# EAGLE design arduino nano pcb (EAGLE 9.6.2)
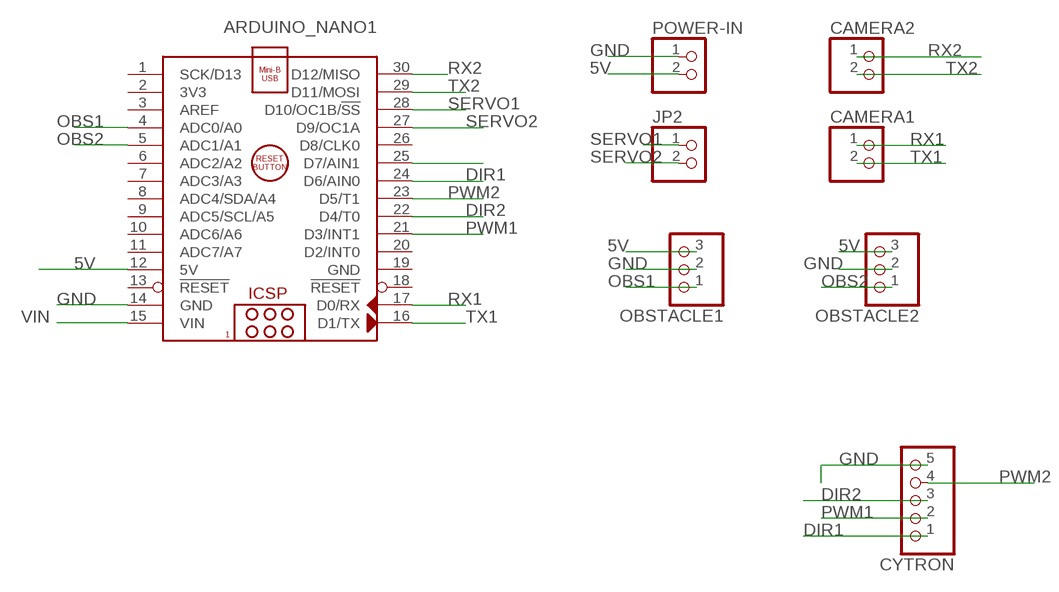
[diagram p0: schematic, sheet 1]

## Parts
ARDUINO_NANO1  ARDUINO_NANO  [ARDUINO_NANO]
CAMERA1  PINHD-1X2  [1X02]
CAMERA2  PINHD-1X2  [1X02]
CYTRON  PINHD-1X5  [1X05]
JP2  PINHD-1X2  [1X02]
OBSTACLE1  PINHD-1X3  [1X03]
OBSTACLE2  PINHD-1X3  [1X03]
POWER-IN  PINHD-1X2  [1X02]

## Nets
5V: ARDUINO_NANO1.12(5V) OBSTACLE1.3 OBSTACLE2.3 POWER-IN.2
DIR1: ARDUINO_NANO1.24(D6/AIN0) CYTRON.1
DIR2: ARDUINO_NANO1.22(D4/T0) CYTRON.3
GND: ARDUINO_NANO1.14(GND) CYTRON.5 OBSTACLE1.2 OBSTACLE2.2 POWER-IN.1
N$6: ARDUINO_NANO1.25(D7/AIN1)
OBS1: ARDUINO_NANO1.4(ADC0/A0) OBSTACLE1.1
OBS2: ARDUINO_NANO1.5(ADC1/A1) OBSTACLE2.1
PWM1: ARDUINO_NANO1.21(D3/INT1) CYTRON.2
PWM2: ARDUINO_NANO1.23(D5/T1) CYTRON.4
RX1: ARDUINO_NANO1.17(D0/RX) CAMERA1.1
RX2: ARDUINO_NANO1.30(D12/MISO) CAMERA2.1
SERVO1: ARDUINO_NANO1.28(D10/OC1B/!SS) JP2.1
SERVO2: ARDUINO_NANO1.27(D9/OC1A) JP2.2
TX1: ARDUINO_NANO1.16(D1/TX) CAMERA1.2
TX2: ARDUINO_NANO1.29(D11/MOSI) CAMERA2.2
VIN: ARDUINO_NANO1.15(VIN)
Unconnected: ARDUINO_NANO1.1(SCK/D13) ARDUINO_NANO1.2(3V3) ARDUINO_NANO1.3(AREF) ARDUINO_NANO1.6(ADC2/A2) ARDUINO_NANO1.7(ADC3/A3) ARDUINO_NANO1.8(ADC4/SDA/A4) ARDUINO_NANO1.9(ADC5/SCL/A5) ARDUINO_NANO1.10(ADC6/A6) ARDUINO_NANO1.11(ADC7/A7) ARDUINO_NANO1.13(!RESET) ARDUINO_NANO1.18(!RESET) ARDUINO_NANO1.20(D2/INT0) ARDUINO_NANO1.26(D8/CLK0)

## Power pins joined to a net without a drawn wire
GND: ARDUINO_NANO1.19(GND)

## Library data of the parts
ARDUINO_NANO1 = ArduinoNanoV30:ARDUINO_NANO: Arduino Nano V3.0 Module Overview: The Arduino Nano is a small, complete, and breadboard-friendly board based on the ATmega328 (Arduino Nano 3.x) or ATmega168 (Arduino Nano 2.x). It has more or less the same functionality of the Arduino Duemilanove, but in a different package. It lacks only a DC power jack, and works with a Mini-B USB cable instead of a standard one. The Nano was designed and is being produced by Gravitech <http://www.gravitech.us/arna30wiatp.html>. General specifications: Item Value Microcontroller Atmel ATmega168 or ATmega328 Operating Voltage (logic level) 5 V Input Voltage (recommended) 7-12 V Input Voltage (limits) 6-20 V Digital I/O Pins 14 (of which 6 provide PWM output) Analog Input Pins 8 DC Current per I/O Pin 40 mA Flash Memory 16 KB (ATmega168) or 32 KB (ATmega328) of which 2 KB used by bootloader SRAM 1 KB (ATmega168) or 2 KB (ATmega328) EEPROM 512 bytes (ATmega168) or 1 KB (ATmega328) Clock Speed 16 MHz Dimensions (Inches) 0.73" x 1.70" Dimensions (mm) 18mm x 45mm Overall height About 9 mm (not including pins) Weigth 5 g Power: The Arduino Nano can be powered via the Mini-B USB connection, 6-20V unregulated external power supply (pin 30), or 5V regulated external power supply (pin 27). The power source is automatically selected to the highest voltage source. Memory: The ATmega168 has 16 KB of flash memory for storing code (of which 2 KB is used for the bootloader); the ATmega328 has 32 KB, (also with 2 KB used for the bootloader). The ATmega168 has 1 KB of SRAM and 512 bytes of EEPROM (which can be read and written with the EEPROM library); the ATmega328 has 2 KB of SRAM and 1 KB of EEPROM. Input and Output: Each of the 14 digital pins on the Nano can be used as an input or output, using pinMode(), digitalWrite(), and digitalRead() functions. They operate at 5 volts. Each pin can provide or receive a maximum of 40 mA and has an internal pull-up resistor (disconnected by default) of 20-50 kOhms. In addition, some pins have specialized functions. Visit Arduino - ArduinoBoardNano <https://www.arduino.cc/en/Main/ArduinoBoardNano>
CAMERA1 CAMERA2 JP2 POWER-IN = pinhead:PINHD-1X2: PIN HEADER
CYTRON = pinhead:PINHD-1X5: PIN HEADER
OBSTACLE1 OBSTACLE2 = pinhead:PINHD-1X3: PIN HEADER

## Board
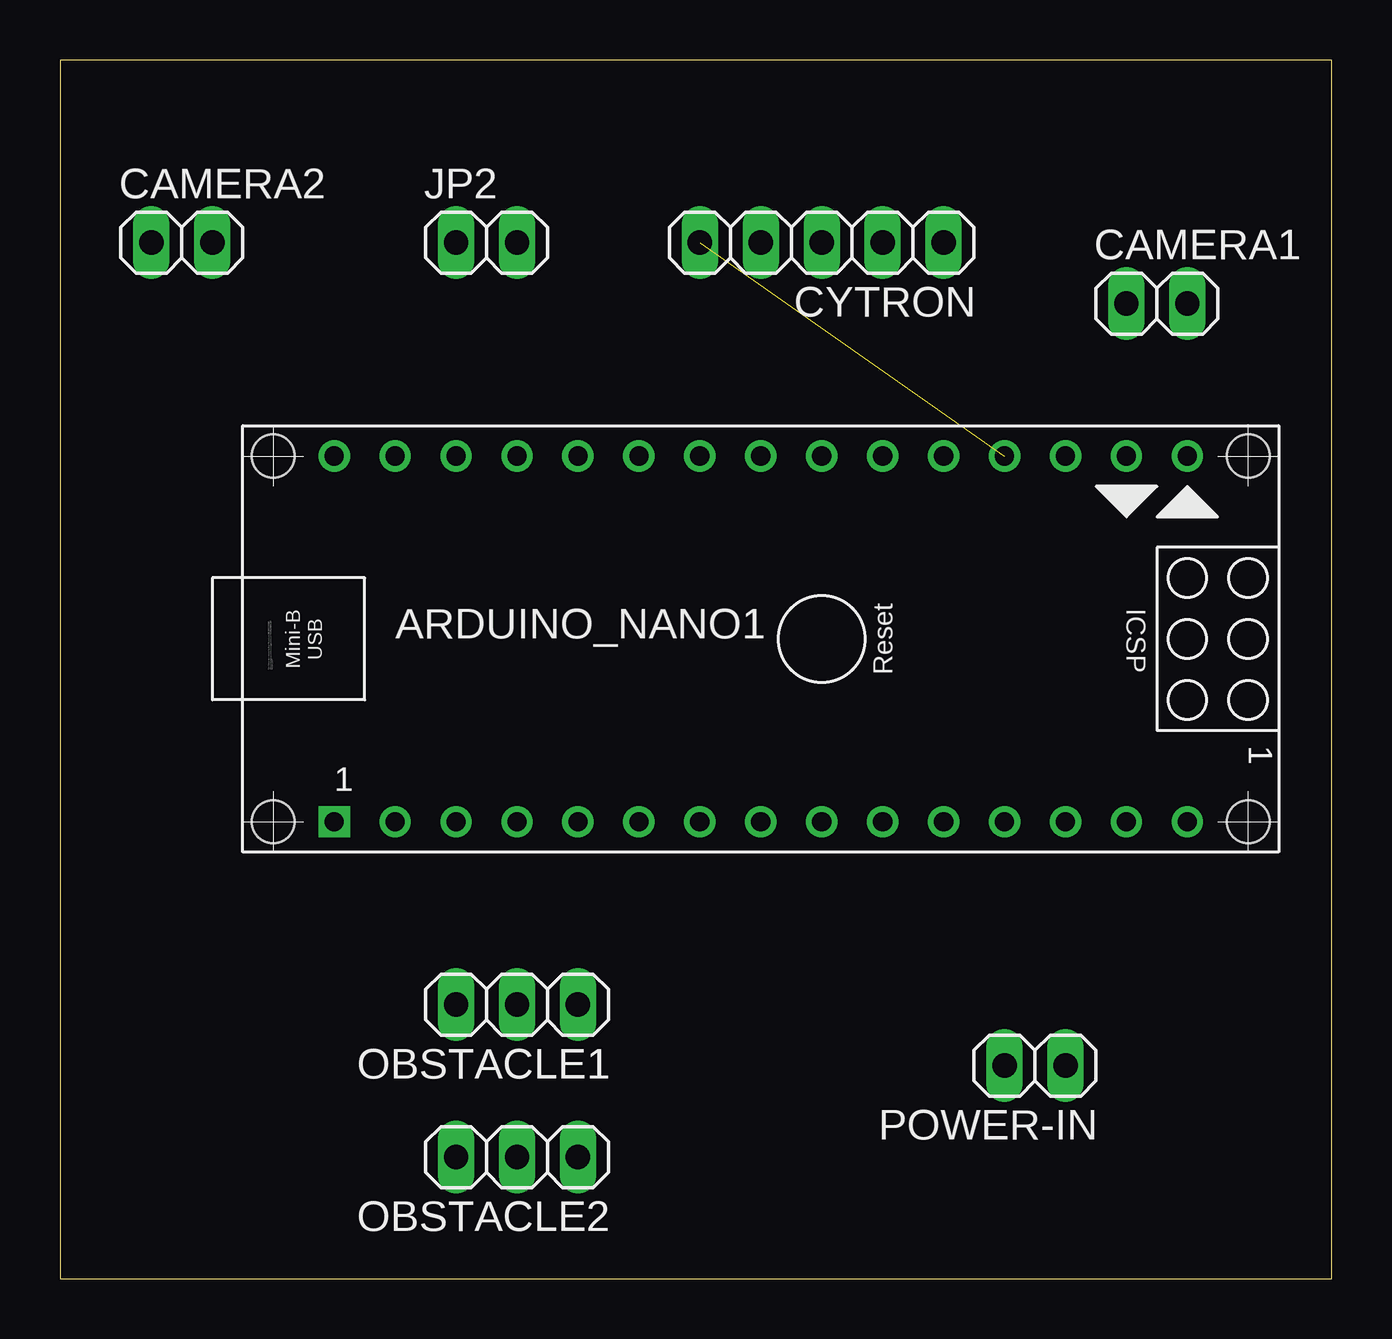
[diagram p1: board, top side]
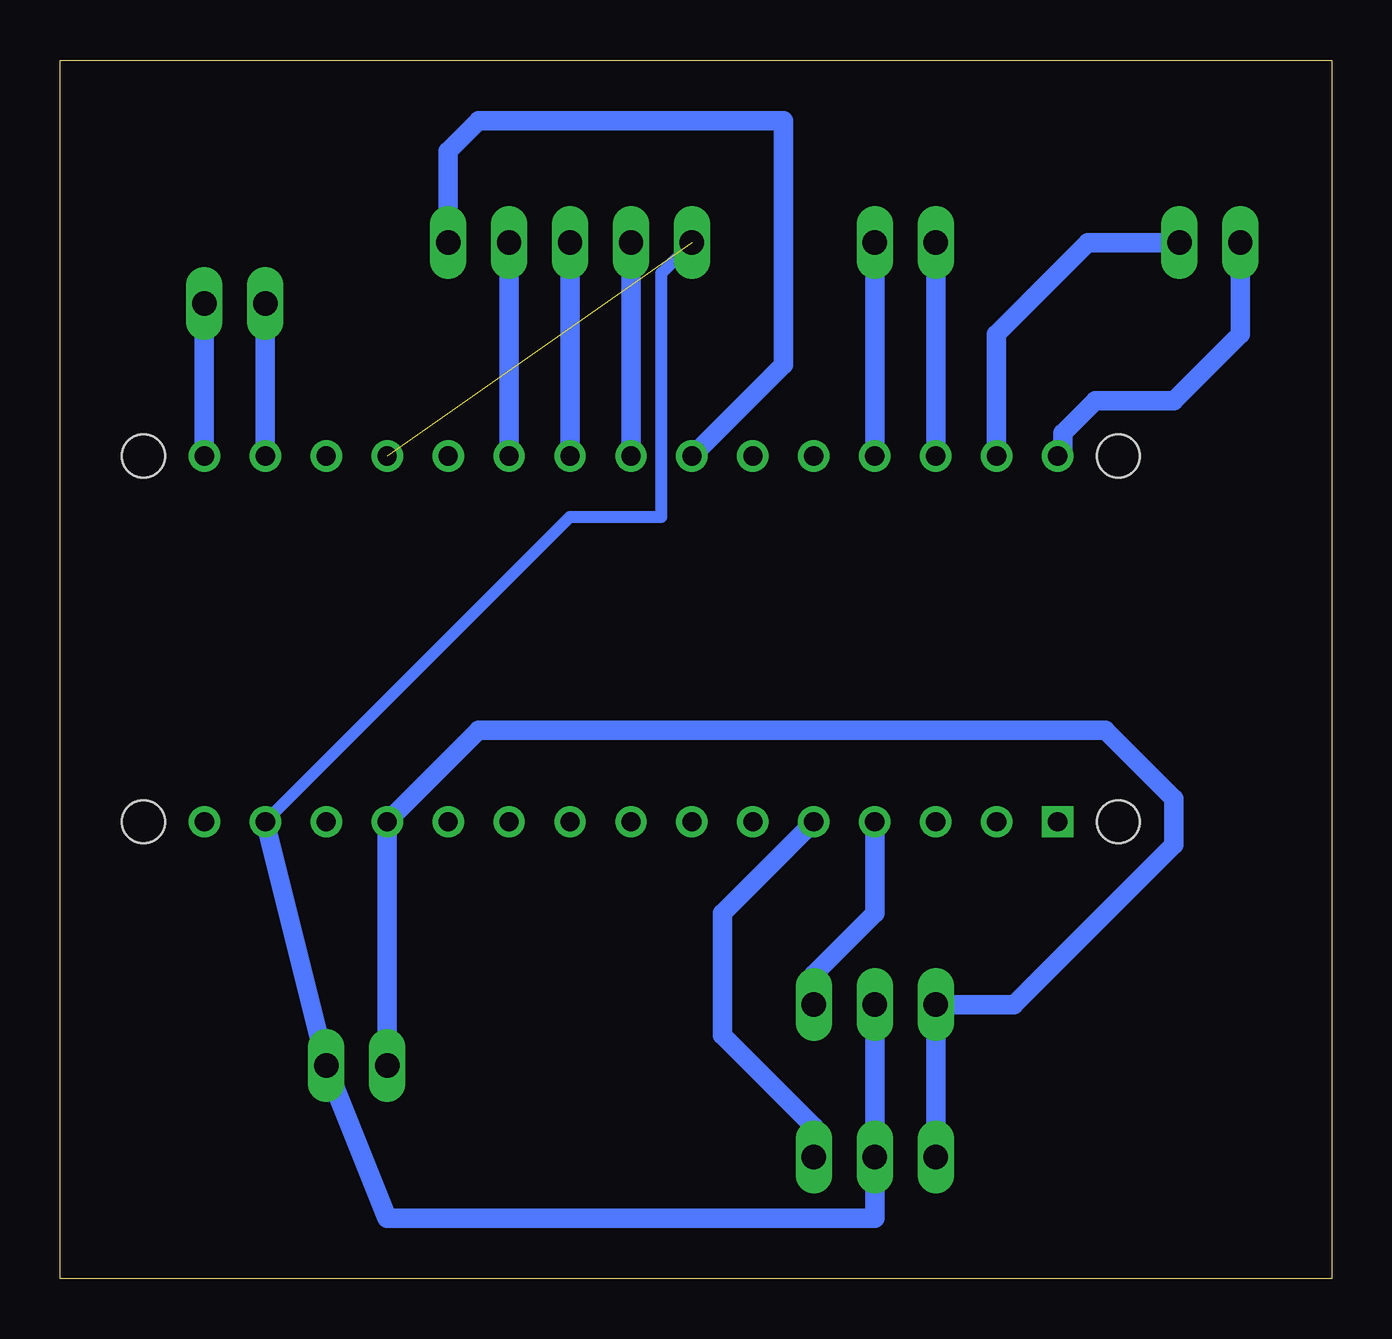
[diagram p2: board, bottom side, seen from below]

Size 53.01 x 50.79 mm. Coordinates in mm from the lower left corner, seen from the top.
Outline: 0,0 53.01,0 53.01,50.79 0,50.79 0,0
Copper layers (1*16): Top 0.035mm / dielectric 1.5mm / Bottom 0.035mm
Design rules "default": minimum track width 6mil, minimum drill 0.35mm, track to track 6mil, track to pad 6mil, pad to pad 6mil, via to via 6mil, smd to smd 6mil, copper to edge 40mil, drill to drill 6mil, minimum pad ring 10mil, minimum via ring 8mil, stop-mask expansion 4mil, vias tented up to drill 0mil, thermal gap 10mil

### Footprints (pad centres in the part's own frame; a part is rotated, then mirrored left to right if it is on the bottom)
ARDUINO_NANO = drill 0.8 square: 1 -20.32,-7.62 | drill 0.8: 2 -17.78,-7.62; 3 -15.24,-7.62; 4 -12.7,-7.62; 5 -10.16,-7.62; 6 -7.62,-7.62; 7 -5.08,-7.62; 8 -2.54,-7.62; 9 0,-7.62; 10 2.54,-7.62; 11 5.08,-7.62; 12 7.62,-7.62; 13 10.16,-7.62; 14 12.7,-7.62; 15 15.24,-7.62; 16 15.24,7.62; 17 12.7,7.62; 18 10.16,7.62; 19 7.62,7.62; 20 5.08,7.62; 21 2.54,7.62; 22 0,7.62; 23 -2.54,7.62; 24 -5.08,7.62; 25 -7.62,7.62; 26 -10.16,7.62; 27 -12.7,7.62; 28 -15.24,7.62; 29 -17.78,7.62; 30 -20.32,7.62 | hole 1.778: -22.86,-7.62; -22.86,7.62; 17.78,7.62; 17.78,-7.62
1X02 = drill 1.016 long: 1 -1.27,0; 2 1.27,0
1X05 = drill 1.016 long: 1 -5.08,0; 2 -2.54,0; 3 0,0; 4 2.54,0; 5 5.08,0
1X03 = drill 1.016 long: 1 -2.54,0; 2 0,0; 3 2.54,0

### Placement (x,y rotation side)
ARDUINO_NANO1  31.75,26.67 0 top
CAMERA1  45.72,40.64 0 top
CAMERA2  5.08,43.18 0 top
CYTRON  31.75,43.18 180 top
JP2  17.78,43.18 0 top
OBSTACLE1  19.05,11.43 180 top
OBSTACLE2  19.05,5.08 180 top
POWER-IN  40.64,8.89 180 top

### Tracks (layer width: path | path; a pad name or v marks a point on that pad's centre or on a via)
5V
  Bottom 0.813: OBSTACLE2.3 OBSTACLE1.3 13.24,11.43 6.58,18.09 6.58,20.01 9.43,22.86 35.56,22.86 ARDUINO_NANO1.12 POWER-IN.2
DIR1
  Bottom 0.813: CYTRON.1 36.83,46.99 35.56,48.26 22.86,48.26 22.86,38.1 ARDUINO_NANO1.24
DIR2
  Bottom 0.813: CYTRON.3 ARDUINO_NANO1.22
GND  (1 unrouted)
  Bottom 0.508: ARDUINO_NANO1.14 31.75,31.75 27.94,31.75 27.94,41.91 CYTRON.5
  Bottom 0.813: OBSTACLE1.2 OBSTACLE2.2 19.05,2.54 39.37,2.54 POWER-IN.1 ARDUINO_NANO1.14
OBS1
  Bottom 0.813: OBSTACLE1.1 21.59,12.7 19.05,15.24 ARDUINO_NANO1.4
OBS2
  Bottom 0.813: OBSTACLE2.1 21.59,6.35 25.4,10.16 25.4,15.24 ARDUINO_NANO1.5
PWM1
  Bottom 0.813: CYTRON.2 ARDUINO_NANO1.21
PWM2
  Bottom 0.813: CYTRON.4 ARDUINO_NANO1.23
RX1
  Bottom 0.813: CAMERA1.1 ARDUINO_NANO1.17
RX2
  Bottom 0.813: CAMERA2.1 3.81,39.37 6.58,36.6 9.85,36.6 11.2,35.25 11.2,34.52 ARDUINO_NANO1.30
SERVO1
  Bottom 0.813: JP2.1 ARDUINO_NANO1.28
SERVO2
  Bottom 0.813: JP2.2 ARDUINO_NANO1.27
TX1
  Bottom 0.813: CAMERA1.2 ARDUINO_NANO1.16
TX2
  Bottom 0.813: CAMERA2.2 10.16,43.18 13.97,39.37 ARDUINO_NANO1.29